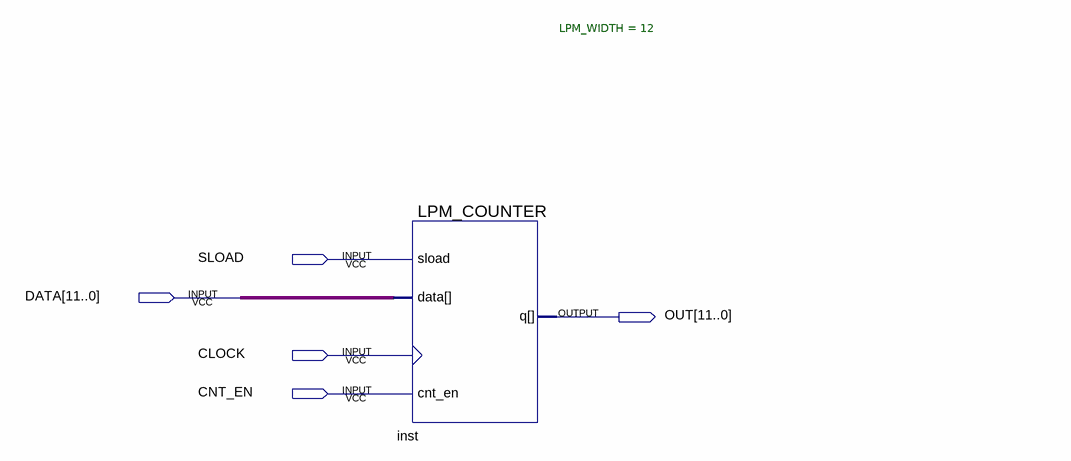
[diagram p0: schematic sheet]
// Quartus schematic PC_TEST.bdf as structural Verilog: 1 symbols, 5 pins
module PC_TEST (
  input  SLOAD,
  input  [11:0] DATA,
  input  CLOCK,
  input  CNT_EN,
  output [11:0] OUT
);

  LPM_COUNTER #(.LPM_WIDTH(12)) inst (.clock(CLOCK), .cnt_en(CNT_EN), .data(DATA), .sload(SLOAD), .q(OUT));
endmodule
